# EAGLE design ECE411GroupTwoWordClockV5 (EAGLE 9.2.0)
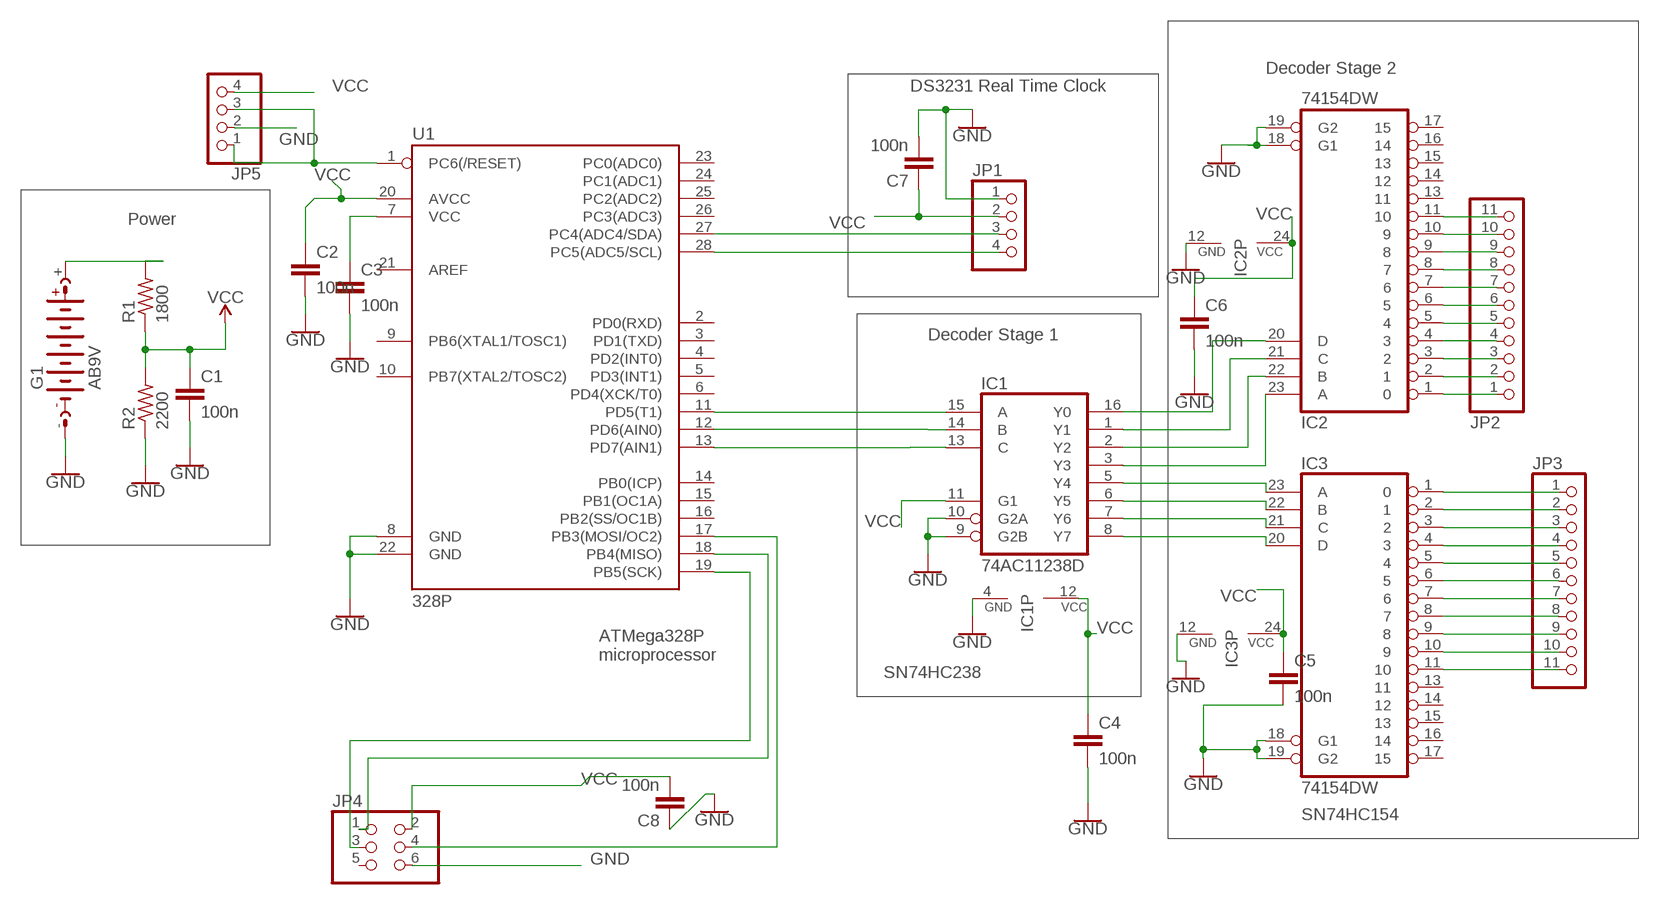
[diagram p0: schematic, sheet 1]

## Parts
C1  100n  C-EU025-025X050  [C025-025X050]
C2  100n  C-EU025-025X050  [C025-025X050]
C3  100n  C-EU025-025X050  [C025-025X050]
C4  100n  C-EU025-025X050  [C025-025X050]
C5  100n  C-EU025-025X050  [C025-025X050]
C6  100n  C-EU025-025X050  [C025-025X050]
C7  100n  C-EU025-025X050  [C025-025X050]
C8  100n  C-EU025-025X050  [C025-025X050]
G1  AB9V  [AB9V]
IC1  74AC11238D  [SO16]
IC2  74154DW  [SO24W]
IC3  74154DW  [SO24W]
JP1  PINHD-1X4  [1X04]
JP2  PINHD-1X11  [1X11]
JP3  PINHD-1X11  [1X11]
JP4  PINHD-2X3  [2X03]
JP5  PINHD-1X4  [1X04]
R1  1800  R-US_0204/2V  [0204V]
R2  2200  R-US_0204/2V  [0204V]
U1  328P  ATMEGA328P_PDIP  [DIP28]

## Nets
GND: C1.2 C2.2 C3.2 C4.2 C5.2 C6.2 C7.2 C8.1 G1.- IC1.4(GND) IC1.9(G2B) IC1.10(G2A) IC2.12(GND) IC2.18(G1) IC2.19(G2) IC3.12(GND) IC3.18(G1) IC3.19(G2) JP1.1 JP4.6 JP5.2 R2.1 U1.8(GND) U1.22(GND)
N$1: G1.+ R1.2
N$2: JP1.4 U1.28(PC5(ADC5/SCL))
N$3: JP1.3 U1.27(PC4(ADC4/SDA))
N$4: IC1.15(A) U1.11(PD5(T1))
N$5: C3.1 U1.7(VCC)
N$6: IC1.13(C) U1.13(PD7(AIN1))
N$7: IC1.3(Y3) IC2.23(A)
N$8: IC1.2(Y2) IC2.22(B)
N$9: IC1.1(Y1) IC2.21(C)
N$10: IC1.16(Y0) IC2.20(D)
N$11: IC2.1 JP2.1
N$12: IC2.2 JP2.2
N$13: IC2.3 JP2.3
N$14: IC2.4 JP2.4
N$15: IC2.5 JP2.5
N$16: IC1.14(B) U1.12(PD6(AIN0))
N$17: IC2.6 JP2.6
N$18: IC2.7 JP2.7
N$19: IC2.8 JP2.8
N$20: IC2.9 JP2.9
N$21: IC2.10 JP2.10
N$22: IC1.5(Y4) IC3.23(A)
N$23: IC1.6(Y5) IC3.22(B)
N$24: IC1.7(Y6) IC3.21(C)
N$25: IC3.1 JP3.1
N$26: IC1.8(Y7) IC3.20(D)
N$27: IC3.2 JP3.2
N$28: IC3.3 JP3.3
N$29: IC3.4 JP3.4
N$30: IC3.5 JP3.5
N$31: IC3.6 JP3.6
N$32: IC3.7 JP3.7
N$33: IC3.8 JP3.8
N$34: IC3.9 JP3.9
N$35: IC3.10 JP3.10
N$36: IC3.11 JP3.11
N$37: IC2.11 JP2.11
N$38: JP4.1 U1.18(PB4(MISO))
N$41: JP4.3 U1.19(PB5(SCK))
N$42: JP4.4 U1.17(PB3(MOSI/OC2))
N$43: JP5.1 JP5.3 U1.1(PC6(/RESET))
VCC: C1.1 C2.1 C4.1 C5.1 C6.1 C7.1 C8.2 IC1.11(G1) IC1.12(VCC) IC2.24(VCC) IC3.24(VCC) JP1.2 JP4.2 JP5.4 R1.1 R2.2 U1.20(AVCC)
Unconnected: IC2.13 IC2.14 IC2.15 IC2.16 IC2.17 IC3.13 IC3.14 IC3.15 IC3.16 IC3.17 JP4.5 U1.2(PD0(RXD)) U1.3(PD1(TXD)) U1.4(PD2(INT0)) U1.5(PD3(INT1)) U1.6(PD4(XCK/T0)) U1.9(PB6(XTAL1/TOSC1)) U1.10(PB7(XTAL2/TOSC2)) U1.14(PB0(ICP)) U1.15(PB1(OC1A)) U1.16(PB2(SS/OC1B)) U1.21(AREF) U1.23(PC0(ADC0)) U1.24(PC1(ADC1)) U1.25(PC2(ADC2)) U1.26(PC3(ADC3))

## Notes on the sheet
- Decoder Stage 2
- DS3231 Real Time Clock
- Power
- Decoder Stage 1
- ATMega328P 
  microprocessor
- SN74HC238
- SN74HC154

## Library data of the parts
C1-C8 = resistor:C-EU: CAPACITOR, European symbol
G1 = battery:AB9V: 9-V BATTERY CLIP
IC1 = 74ac-logic:74AC11238: 3 to 8 line DECODER/DEMULTIPLEXER
IC2 IC3 = 74xx-eu:74*154: 4-line to 16-line data SELECTOR/MULTIPLEXER
JP1 JP5 = pinhead:PINHD-1X4: PIN HEADER
JP2 JP3 = pinhead:PINHD-1X11: PIN HEADER
JP4 = pinhead:PINHD-2X3: PIN HEADER
R1 R2 = resistor:R-US_: RESISTOR, American symbol
U1 = SparkFun-IC-Microcontroller:ATMEGA328P_PDIP: Atmel 328P Through hole ATMEGA328P uC used in the Arduino 32kb flash, 1k EEPROM, 2k SRAM Datasheet <http://www.sparkfun.com/datasheets/Components/SMD/ATMega328.pdf> SparkFun Products Storefront component: AVR 28 Pin 20MHz 32K 6A/D - ATMega328P <https://www.sparkfun.com/products/9061> (COM-09061) SparkFun Simon Says - Through-Hole Soldering Kit <https://www.sparkfun.com/products/10547> (KIT-10547) SparkFun Learn to Solder - Simon Says <https://www.sparkfun.com/products/13708> (KIT-13708) SparkFun BigTime Watch Kit <https://www.sparkfun.com/products/11734> (KIT-11734) SparkFun ClockIt <https://www.sparkfun.com/products/10930> (KIT-10930) SparkFun Serial Enabled LCD Kit <https://www.sparkfun.com/products/10097> (LCD-10097) SparkFun Simon Tilts - Through Hole Soldering Kit <https://www.sparkfun.com/products/12634> (KIT-12634) SparkFun Frequency Counter Kit <https://www.sparkfun.com/products/10140> (KIT-10140) FabFM Radio Kit <https://www.sparkfun.com/products/11043> (KIT-11043) SparkFun Binary Blaster Kit <https://www.sparkfun.com/products/12037> (KIT-12037) SparkFun Metro-Gnome <https://www.sparkfun.com/products/9236> (KIT-09236) ATmega328 with Arduino Optiboot (Uno) <https://www.sparkfun.com/products/10524> (DEV-10524); PROD_ID: IC-09136

## Board
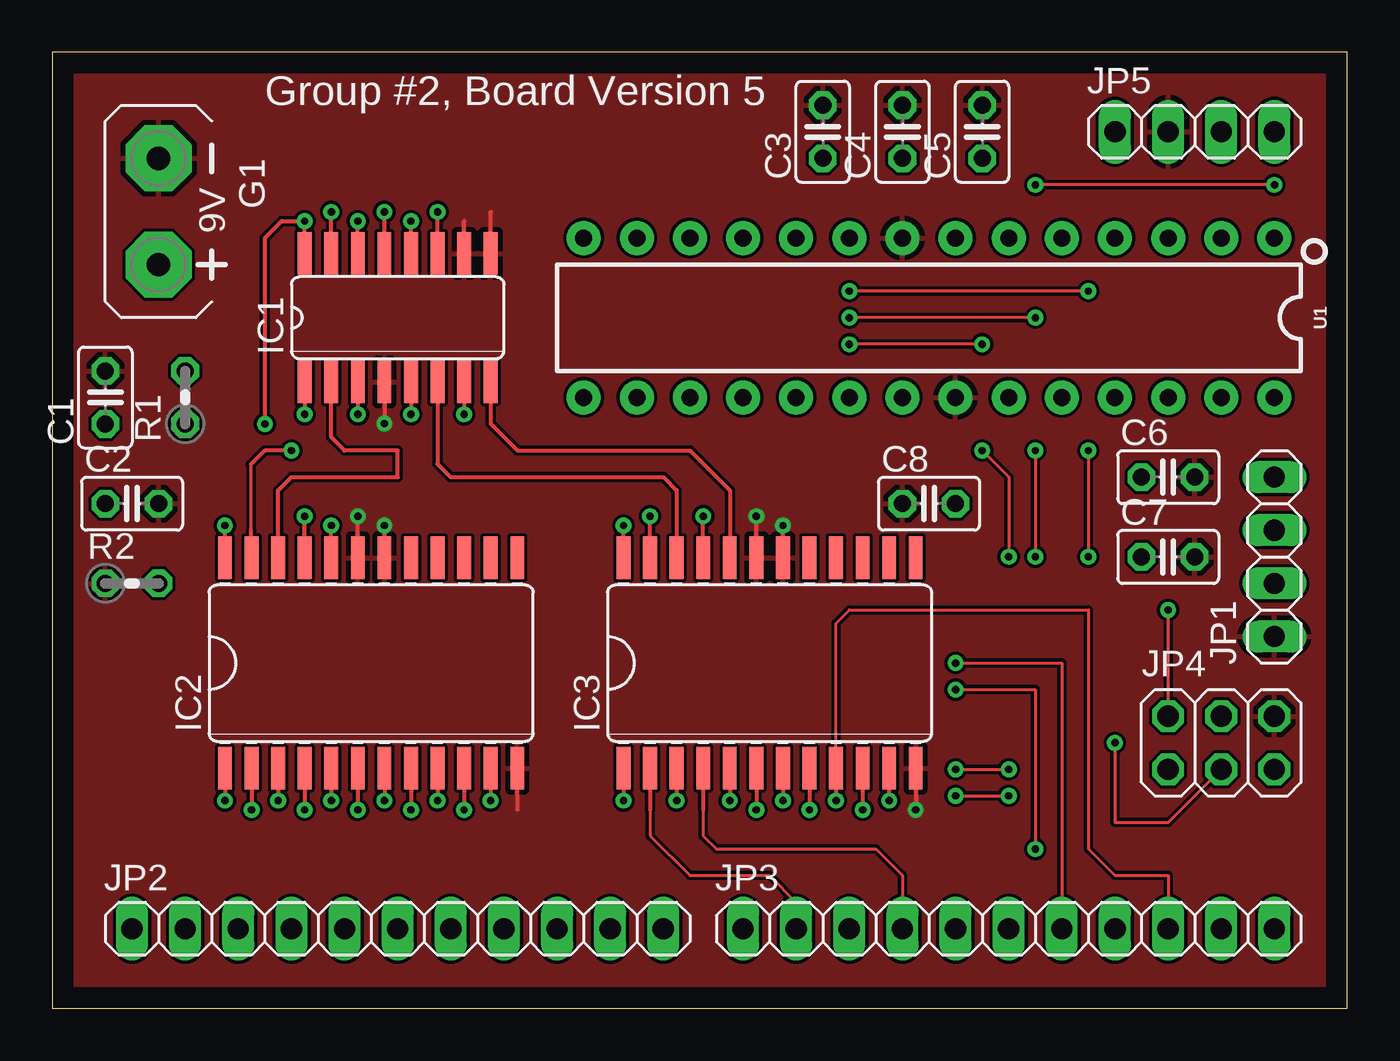
[diagram p1: board, top side]
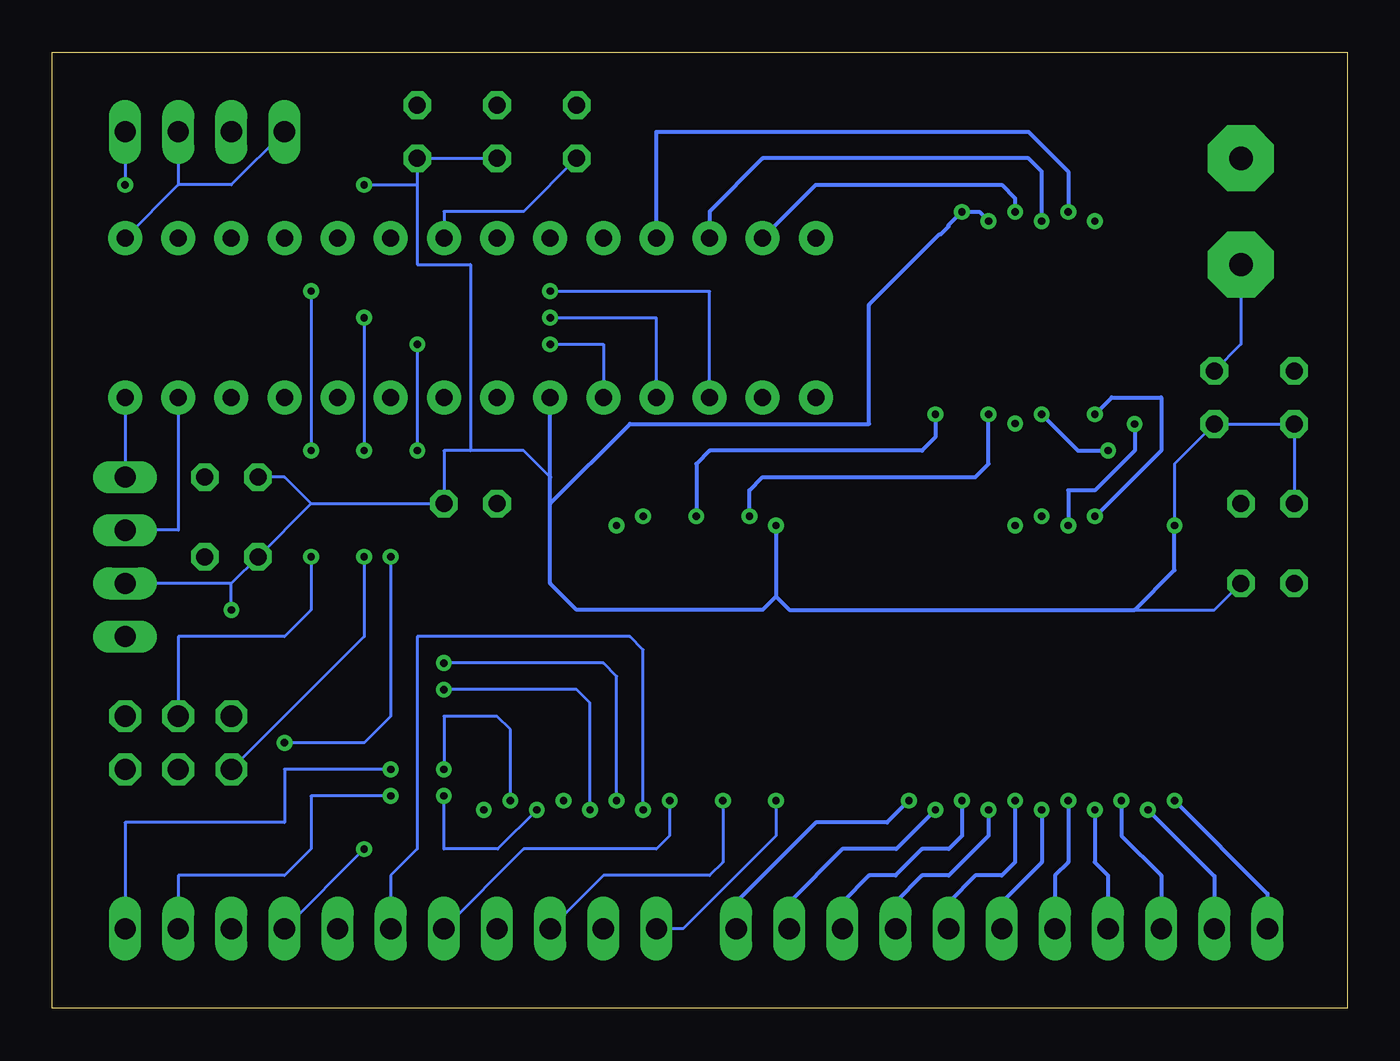
[diagram p2: board, bottom side, seen from below]

Size 61.9 x 45.71 mm. Coordinates in mm from the lower left corner, seen from the top.
Outline: 0,0 61.9,0 61.9,45.71 0,45.71 0,0
Copper layers (1*16): Top 0.035mm / dielectric 1.5mm / Bottom 0.035mm
Design rules "default": minimum track width 6mil, minimum drill 0.35mm, track to track 6mil, track to pad 6mil, pad to pad 6mil, via to via 6mil, smd to smd 6mil, copper to edge 40mil, drill to drill 6mil, minimum pad ring 10mil, minimum via ring 8mil, stop-mask expansion 4mil, vias tented up to drill 0mil, thermal gap 10mil

### Footprints (pad centres in the part's own frame; a part is rotated, then mirrored left to right if it is on the bottom)
C025-025X050 = drill 0.813 octagon: 1 -1.27,0; 2 1.27,0
AB9V = drill 1.118 pad 3.15 octagon: + 0,2.54; - 0,-2.54
SO16 = smd 0.66 x 2.032: 1 -4.445,-3.073; 2 -3.175,-3.073; 3 -1.905,-3.073; 4 -0.635,-3.073; 5 0.635,-3.073; 6 1.905,-3.073; 7 3.175,-3.073; 8 4.445,-3.073; 9 4.445,3.073; 10 3.175,3.073; 11 1.905,3.073; 12 0.635,3.073; 13 -0.635,3.073; 14 -1.905,3.073; 15 -3.175,3.073; 16 -4.445,3.073
SO24W = smd 0.66 x 2.032: 1 -6.985,-5.029; 2 -5.715,-5.029; 3 -4.445,-5.029; 4 -3.175,-5.029; 5 -1.905,-5.029; 6 -0.635,-5.029; 7 0.635,-5.029; 8 1.905,-5.029; 9 3.175,-5.029; 10 4.445,-5.029; 11 5.715,-5.029; 12 6.985,-5.029; 13 6.985,5.029; 14 5.715,5.029; 15 4.445,5.029; 16 3.175,5.029; 17 1.905,5.029; 18 0.635,5.029; 19 -0.635,5.029; 20 -1.905,5.029; 21 -3.175,5.029; 22 -4.445,5.029; 23 -5.715,5.029; 24 -6.985,5.029
1X04 = drill 1.016 long: 1 -3.81,0; 2 -1.27,0; 3 1.27,0; 4 3.81,0
1X11 = drill 1.016 long: 1 -12.7,0; 2 -10.16,0; 3 -7.62,0; 4 -5.08,0; 5 -2.54,0; 6 0,0; 7 2.54,0; 8 5.08,0; 9 7.62,0; 10 10.16,0; 11 12.7,0
2X03 = drill 1.016 octagon: 1 -2.54,-1.27; 2 -2.54,1.27; 3 0,-1.27; 4 0,1.27; 5 2.54,-1.27; 6 2.54,1.27
0204V = drill 0.813 octagon: 1 -1.27,0; 2 1.27,0
DIP28 = drill 0.813 pad 1.626: 1 -16.51,-3.81; 2 -13.97,-3.81; 3 -11.43,-3.81; 4 -8.89,-3.81; 5 -6.35,-3.81; 6 -3.81,-3.81; 7 -1.27,-3.81; 8 1.27,-3.81; 9 3.81,-3.81; 10 6.35,-3.81; 11 8.89,-3.81; 12 11.43,-3.81; 13 13.97,-3.81; 14 16.51,-3.81; 15 16.51,3.81; 16 13.97,3.81; 17 11.43,3.81; 18 8.89,3.81; 19 6.35,3.81; 20 3.81,3.81; 21 1.27,3.81; 22 -1.27,3.81; 23 -3.81,3.81; 24 -6.35,3.81; 25 -8.89,3.81; 26 -11.43,3.81; 27 -13.97,3.81; 28 -16.51,3.81

### Placement (x,y rotation side)
C1  2.54,29.21 90 top
C2  3.81,24.13 0 top
C3  36.83,41.91 90 top
C4  40.64,41.91 90 top
C5  44.45,41.91 90 top
C6  53.34,25.4 0 top
C7  53.34,21.59 0 top
C8  41.91,24.13 0 top
G1  5.08,38.1 180 top
IC1  16.51,33.02 0 top
IC2  15.24,16.51 0 top
IC3  34.29,16.51 0 top
JP1  58.42,21.59 90 top
JP2  16.51,3.81 0 top
JP3  45.72,3.81 0 top
JP4  55.88,12.7 0 top
JP5  54.61,41.91 0 top
R1  6.35,29.21 90 top
R2  3.81,20.32 0 top
U1  41.91,33.02 180 top

### Tracks (layer width: path | path; a pad name or v marks a point on that pad's centre or on a via)
GND  (via drill 0.35)
  Top 0.2: IC1.4 v15.88,27.96 | IC1.10 19.68,37.64 | IC1.9 20.95,38.08 | IC3.12 v41.27,9.49 | IC3.19 v33.66,23.53 | IC3.18 v34.92,23.09 | IC2.12 22.23,9.49 | IC2.19 v14.61,23.53 | IC2.18 v15.88,23.09
  pour Top: -1.27,46.99 -1.27,-1.27 63.5,-1.27 63.5,46.99
N$1
  Bottom 0.152: G1.+ 5.08,31.75 R1.2
N$2
  Bottom 0.152: U1.28 JP1.4
N$3
  Bottom 0.152: U1.27 55.88,22.86 JP1.3
N$4  (via drill 0.35)
  Top 0.2: IC1.15 v13.34,38.08
  Bottom 0.2: U1.11 33.02,41.91 15.24,41.91 13.34,40.01 v13.34,38.08
N$5
  Bottom 0.152: C3.1 39.37,38.1 43.18,38.1 U1.7
N$6  (via drill 0.35)
  Top 0.2: IC1.13 v15.88,38.08
  Bottom 0.2: U1.13 25.4,39.37 16.51,39.37 15.88,38.74 v15.88,38.08
N$7  (via drill 0.35)
  Top 0.152: 9.5,22.85 9.5,25.99 9.49,26
  Top 0.2: IC2.23 9.5,22.85 | IC1.3 v14.61,28.4 | 9.49,26 10.16,26.67 v11.43,26.67
  Bottom 0.2: v11.43,26.67 12.88,26.67 v14.61,28.4
N$8
  Top 0.2: IC2.22 10.79,22.86 10.79,23.09 10.79,24.77 11.43,25.4 16.51,25.4 16.51,26.67 13.97,26.67 13.34,27.3 IC1.2
N$9  (via drill 0.35)
  Top 0.2: IC1.1 v12.06,28.4 | IC2.21 v12.06,23.53
  Bottom 0.2: v12.06,23.53 12.03,23.53 8.89,26.67 8.89,29.21 11.26,29.21 v12.06,28.4
N$10  (via drill 0.35)
  Top 0.2: IC1.16 v12.06,37.64 10.97,37.64 10.16,36.83 v10.16,27.94 | IC2.20 v13.34,23.09
  Bottom 0.2: v13.34,23.09 13.34,24.77 12.06,24.77 10.16,26.67 v10.16,27.94
N$11  (via drill 0.35)
  Top 0.2: IC2.1 v8.26,9.93
  Bottom 0.2: v8.26,9.93 3.81,5.49 JP2.1
N$12  (via drill 0.35)
  Top 0.2: IC2.2 v9.53,9.49
  Bottom 0.2: v9.53,9.49 6.35,6.32 JP2.2
N$13  (via drill 0.35)
  Top 0.2: IC2.3 v10.79,9.93
  Bottom 0.2: v10.79,9.93 10.79,8.26 8.89,6.35 JP2.3
N$14  (via drill 0.35)
  Top 0.2: IC2.4 v12.06,9.49
  Bottom 0.2: v12.06,9.49 12.06,6.98 11.43,6.35 JP2.4
N$15  (via drill 0.35)
  Top 0.2: IC2.5 v13.34,9.93
  Bottom 0.2: v13.34,9.93 13.34,6.98 13.97,6.35 JP2.5
N$16  (via drill 0.35)
  Top 0.2: IC1.14 v14.61,37.64
  Bottom 0.2: v14.61,37.64 14.61,40.01 15.24,40.64 27.94,40.64 30.48,38.1 U1.12
N$17  (via drill 0.35)
  Top 0.2: IC2.6 v14.61,9.49
  Bottom 0.2: v14.61,9.49 14.61,6.98 16.51,5.08 JP2.6
N$18  (via drill 0.35)
  Top 0.2: IC2.7 v15.88,9.93
  Bottom 0.2: v15.88,9.93 15.88,6.98 16.51,6.35 17.78,6.35 19.05,5.08 JP2.7
N$19  (via drill 0.35)
  Top 0.2: IC2.8 v17.14,9.49
  Bottom 0.2: v17.14,9.49 17.14,8.26 19.05,6.35 20.32,6.35 21.59,5.08 JP2.8
N$20  (via drill 0.35)
  Top 0.2: IC2.9 v18.41,9.93
  Bottom 0.2: v18.41,9.93 18.41,8.26 19.05,7.62 20.32,7.62 21.59,6.35 22.86,6.35 24.13,5.08 JP2.9
N$21  (via drill 0.35)
  Top 0.2: IC2.10 v19.68,9.49
  Bottom 0.2: v19.68,9.49 21.56,7.62 24.13,7.62 26.67,5.08 JP2.10
N$22  (via drill 0.35)
  Top 0.2: IC1.5 v17.14,28.4 | IC3.23 v28.57,23.53
  Bottom 0.2: v28.57,23.53 28.57,24.77 27.94,25.4 17.78,25.4 17.14,26.04 v17.14,28.4
N$23
  Top 0.2: IC1.6 18.41,26.04 19.05,25.4 29.21,25.4 29.84,24.77 IC3.22
N$24  (via drill 0.35)
  Top 0.2: IC1.7 v19.68,28.4 | IC3.21 v31.11,23.53
  Bottom 0.2: v19.68,28.4 19.68,27.3 20.32,26.67 30.48,26.67 31.11,26.04 v31.11,23.53
N$25  (via drill 0.35)
  Top 0.2: IC3.1 v27.3,9.93
  Bottom 0.152: v27.3,9.93 27.3,8.26 31.75,3.81 JP3.1
N$26
  Top 0.2: IC1.8 20.95,27.96 22.24,26.67 30.48,26.67 32.38,24.77 IC3.20
N$27
  Top 0.152: 28.57,9.49 28.57,8.26 30.48,6.35 34.29,6.35 35.56,5.08 JP3.2
  Top 0.2: IC3.2 28.57,9.49
N$28  (via drill 0.35)
  Top 0.2: IC3.3 v29.84,9.93
  Bottom 0.152: v29.84,9.93 29.84,6.98 30.48,6.35 35.56,6.35 JP3.3
N$29
  Top 0.152: 31.11,9.49 31.11,8.26 31.75,7.62 39.37,7.62 40.64,6.35 JP3.4
  Top 0.2: IC3.4 31.11,9.49
N$30  (via drill 0.35)
  Top 0.2: IC3.5 v32.38,9.93
  Bottom 0.152: v32.38,9.93 32.38,8.26 33.02,7.62 39.37,7.62 JP3.5
N$31  (via drill 0.35)
  Top 0.2: IC3.6 v33.66,9.49
  Bottom 0.152: v33.66,9.49 33.66,17.15 34.29,17.78 44.45,17.78 44.45,7.62 45.72,6.35 JP3.6
N$32  (via drill 0.35)
  Top 0.152: v43.18,16.51 48.26,16.51 JP3.7
  Top 0.2: IC3.7 v34.92,9.93
  Bottom 0.152: v34.92,9.93 34.92,15.88 35.56,16.51 v43.18,16.51
N$33  (via drill 0.35)
  Top 0.152: v43.18,15.24 46.99,15.24 v46.99,7.62
  Top 0.2: IC3.8 v36.2,9.49
  Bottom 0.152: v36.2,9.49 36.2,14.61 36.83,15.24 v43.18,15.24 | v46.99,7.62 JP3.8
N$34  (via drill 0.35)
  Top 0.152: v37.47,9.93 37.47,18.41 38.1,19.05 49.53,19.05 49.53,7.62 50.8,6.35 53.34,6.35 JP3.9
  Top 0.2: IC3.9 v37.47,9.93
N$35  (via drill 0.35)
  Top 0.152: v43.18,10.16 v45.72,10.16
  Top 0.2: IC3.10 v38.73,9.49
  Bottom 0.152: v38.73,9.49 40.61,7.62 43.18,7.62 v43.18,10.16 | v45.72,10.16 49.53,10.16 49.53,7.62 50.8,6.35 55.88,6.35 JP3.10
N$36  (via drill 0.35)
  Top 0.152: v43.18,11.43 v45.72,11.43
  Top 0.2: IC3.11 v40.01,9.93
  Bottom 0.152: v40.01,9.93 40.01,13.34 40.64,13.97 43.18,13.97 v43.18,11.43 | v45.72,11.43 50.8,11.43 50.8,8.89 58.42,8.89 JP3.11
N$37  (via drill 0.35)
  Top 0.2: IC2.11 v20.95,9.93
  Bottom 0.2: v20.95,9.93 22,8.89 25.4,8.89 29.21,5.08 JP2.11
N$38  (via drill 0.35)
  Top 0.152: v46.99,26.67 v46.99,21.59 | v46.99,33.02 v38.1,33.02
  Bottom 0.152: U1.18 33.02,33.02 v38.1,33.02 | v46.99,33.02 v46.99,26.67 | v46.99,21.59 46.99,17.78 JP4.1
N$41  (via drill 0.35)
  Top 0.152: v44.45,31.75 v38.1,31.75 | v44.45,26.67 45.72,25.4 v45.72,21.59 | v50.8,12.7 50.8,8.89 53.34,8.89 JP4.3
  Bottom 0.152: U1.19 35.56,31.75 v38.1,31.75 | v44.45,31.75 v44.45,26.67 | v45.72,21.59 45.72,13.97 46.99,12.7 v50.8,12.7
N$42  (via drill 0.35)
  Top 0.152: v49.53,34.29 v38.1,34.29 | v49.53,26.67 v49.53,21.59
  Bottom 0.152: U1.17 30.48,34.29 v38.1,34.29 | v49.53,21.59 49.53,19.05 50.8,17.78 55.88,17.78 JP4.4 | v49.53,34.29 v49.53,26.67
N$43
  Bottom 0.152: JP5.3 55.88,39.37 | 55.88,39.37 U1.1 | JP5.1 53.34,39.37 55.88,39.37
VCC  (via drill 0.35)
  Top 0.152: JP4.2 v53.34,19.05 | v58.42,39.37 v46.99,39.37
  Top 0.2: IC1.12 v17.14,37.64 | IC1.11 v18.41,38.08 | IC3.24 v27.3,23.09 | IC2.24 v8.26,23.09
  Bottom 0.152: C2.1 C1.1 R1.1 8.26,26.04 v8.26,23.09 | 10.16,19.05 6.35,19.05 R2.2 | C4.1 C5.1 44.45,39.37 | 44.45,39.37 44.45,35.56 41.91,35.56 41.91,26.67 | 38.1,25.4 39.37,26.67 41.91,26.67 | 41.91,26.67 43.18,26.67 C8.2 49.53,24.13 | 49.53,24.13 50.8,25.4 C6.1 | 49.53,24.13 C7.1 53.34,20.32 | 53.34,20.32 JP1.2 | v53.34,19.05 53.34,20.32 | JP5.4 v58.42,39.37 | v46.99,39.37 44.45,39.37
  Bottom 0.2: v17.14,37.64 17.59,38.08 v18.41,38.08 19.05,37.44 19.05,37.38 19.42,37.01 19.49,37.01 22.86,33.64 22.86,27.94 34.29,27.94 38.1,24.13 | v27.3,23.09 27.3,19.69 | 27.3,19.69 27.94,19.05 36.83,19.05 38.1,20.32 38.1,24.13 | 38.1,24.13 38.1,25.4 U1.20 | 27.3,19.69 26.67,19.05 10.16,19.05 8.26,20.95 v8.26,23.09

### Text on the board
tPlace: Group #2, Board Version 5